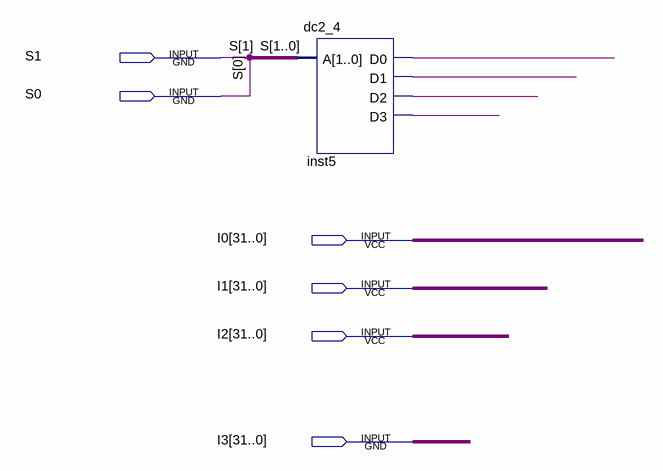
[diagram p0: schematic sheet]
// Quartus schematic mx4_32.bdf as structural Verilog: 1 symbols, 6 pins
module mx4_32 (
  input  S1,
  input  S0,
  input  [31:0] I0,
  input  [31:0] I1,
  input  [31:0] I2,
  input  [31:0] I3
);

  wire inst5_d0, inst5_d1, inst5_d2, inst5_d3;

  dc2_4 inst5 (.A({S1, S0}), .D0(inst5_d0), .D1(inst5_d1), .D2(inst5_d2), .D3(inst5_d3));
endmodule
